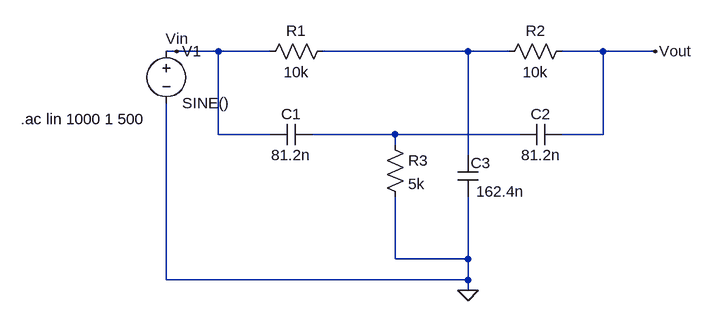
[diagram p0: schematic PassiveNotchFilter.asc]
PassiveNotchFilter.asc, the LTspice schematic file:
Version 4
SHEET 1 880 680
WIRE 80 240 64 240
WIRE 144 240 80 240
WIRE 224 240 144 240
WIRE 528 240 304 240
WIRE 592 240 528 240
WIRE 736 240 672 240
WIRE 816 240 736 240
WIRE 144 368 144 240
WIRE 224 368 144 368
WIRE 416 368 288 368
WIRE 608 368 416 368
WIRE 736 368 736 240
WIRE 736 368 672 368
WIRE 416 384 416 368
WIRE 528 400 528 240
WIRE 416 560 416 464
WIRE 528 560 528 464
WIRE 528 560 416 560
WIRE 64 592 64 320
WIRE 528 592 528 560
WIRE 528 592 64 592
WIRE 528 608 528 592
FLAG 528 608 0
FLAG 80 240 Vin
FLAG 816 240 Vout
SYMBOL Res 320 224 R90
WINDOW 0 0 56 VBottom 2
WINDOW 3 32 56 VTop 2
SYMATTR InstName R1
SYMATTR Value 10k
SYMBOL Res 688 224 R90
WINDOW 0 0 56 VBottom 2
WINDOW 3 32 56 VTop 2
SYMATTR InstName R2
SYMATTR Value 10k
SYMBOL Res 400 368 R0
SYMATTR InstName R3
SYMATTR Value 5k
SYMBOL cap 288 352 R90
WINDOW 0 0 32 VBottom 2
WINDOW 3 32 32 VTop 2
SYMATTR InstName C1
SYMATTR Value 81.2n
SYMBOL cap 672 352 R90
WINDOW 0 0 32 VBottom 2
WINDOW 3 32 32 VTop 2
SYMATTR InstName C2
SYMATTR Value 81.2n
SYMBOL cap 544 464 R180
WINDOW 0 -19 52 Left 2
WINDOW 3 -71 8 Left 2
SYMATTR InstName C3
SYMATTR Value 162.4n
SYMBOL Voltage 64 224 R0
SYMATTR InstName V1
SYMATTR Value SINE()
SYMATTR Value2 AC 1
TEXT -160 344 Left 2 !.ac lin 1000 1 500

The netlist it stands for:
* PassiveNotchFilter.asc
R1 N001 Vin 10k
R2 Vout N001 10k
R3 N002 0 5k
C1 N002 Vin 81.2n
C2 Vout N002 81.2n
C3 0 N001 162.4n
V1 Vin 0 SINE() AC 1
.ac lin 1000 1 500
.backanno
.end